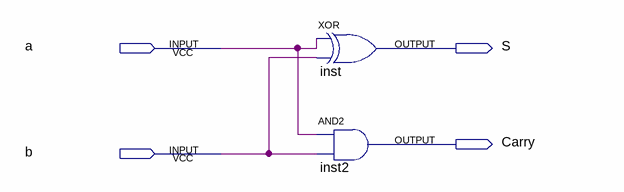
[diagram p0: schematic sheet]
// Quartus schematic half-add.bdf as structural Verilog: 2 symbols, 4 pins
module \half-add  (
  input  a,
  input  b,
  output S,
  output Carry
);

  xor inst (S, a, b);
  and inst2 (Carry, a, b);
endmodule
